# EAGLE design MultiEffect (EAGLE 9.6.2)

## Sheet 1 of 2: Audio & Power
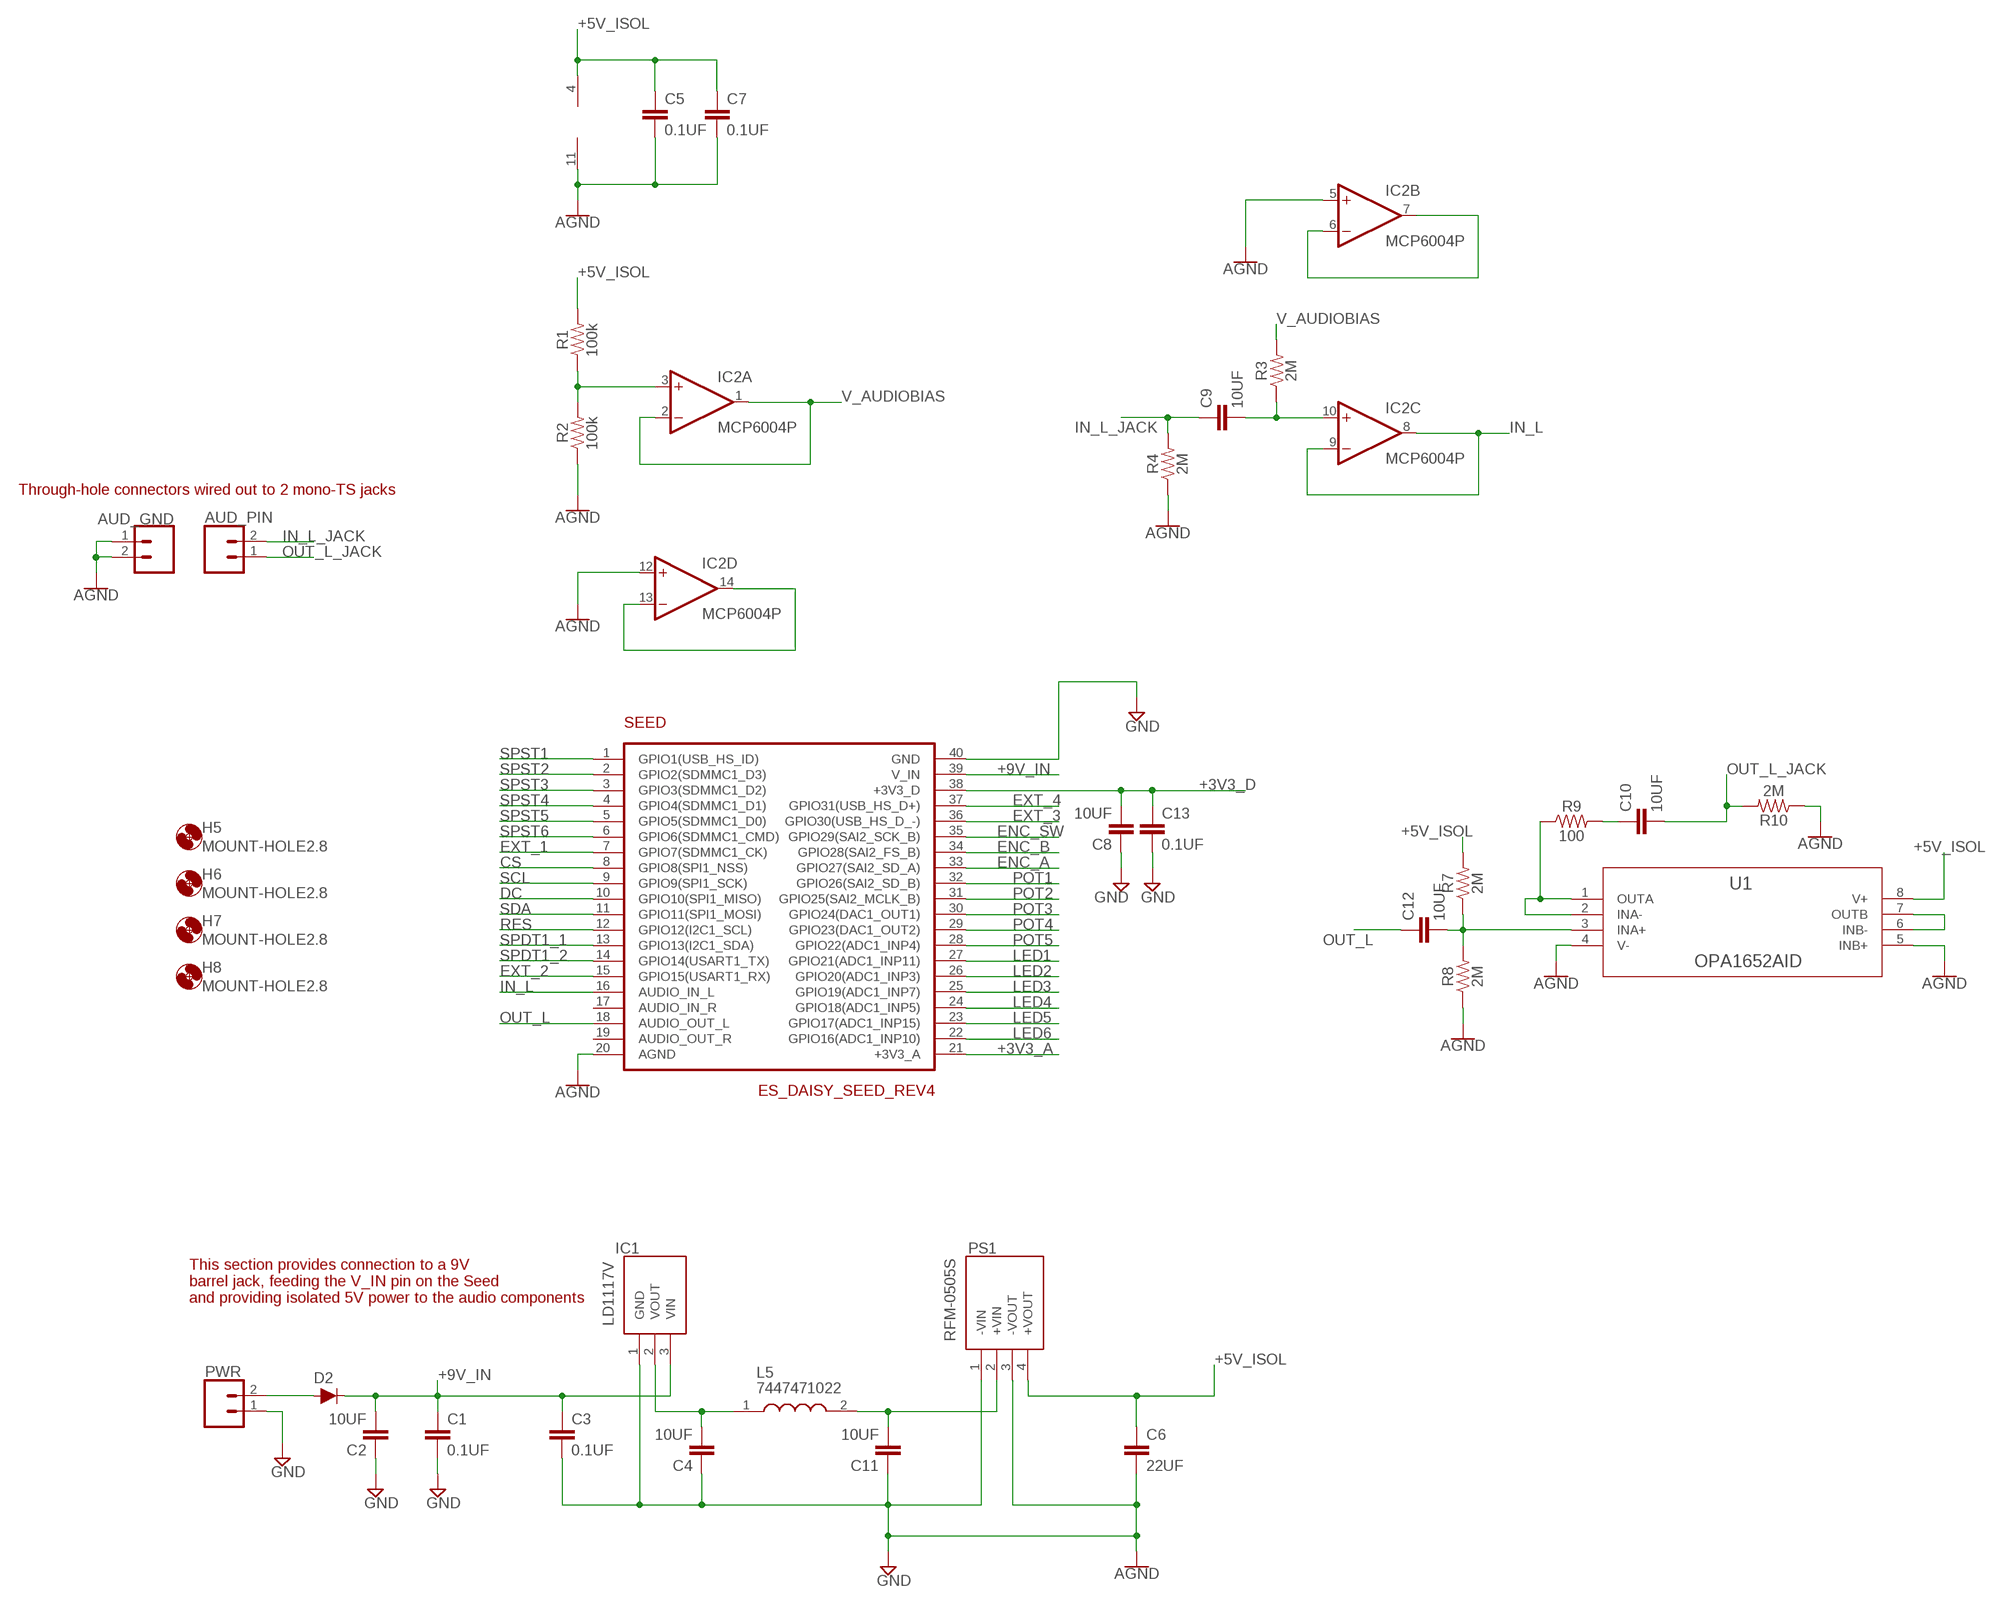
[diagram p0: schematic, sheet 1]

### Parts
AUD_GND  CONN_02  [1X02]
AUD_PIN  CONN_02  [1X02]
C1  0.1UF  [CAP-PTH-SMALL-KIT]
C2  10UF  [CAP-PTH-SMALL-KIT]
C3  0.1UF  [CAP-PTH-SMALL-KIT]
C4  10UF  [CAP-PTH-SMALL-KIT]
C5  0.1UF  [CAP-PTH-SMALL-KIT]
C6  22UF  [CAP-PTH-SMALL-KIT]
C7  0.1UF  [CAP-PTH-SMALL-KIT]
C8  10UF  [CAP-PTH-SMALL-KIT]
C9  10UF  [CAP-PTH-SMALL-KIT]
C10  10UF  [CAP-PTH-SMALL-KIT]
C11  10UF  [CAP-PTH-SMALL-KIT]
C12  10UF  [CAP-PTH-SMALL-KIT]
C13  0.1UF  [CAP-PTH-SMALL-KIT]
D2  200mA/100V/1V  DIODE-1N4148  [DIODE-1N4148]
H5  MOUNT-HOLE2.8  [2,8]
H6  MOUNT-HOLE2.8  [2,8]
H7  MOUNT-HOLE2.8  [2,8]
H8  MOUNT-HOLE2.8  [2,8]
IC1  LD1117V  [TO255P460X1020X2008-3P]
IC2  MCP6004P  [DIL14]
L5  7447471022  [WE-TIS_111190]
PS1  RFM-0505S  [RFM0505S]
PWR  CONN_02  [1X02]
R1  100k  100KOHM-HORIZ-1/4W-5%  [AXIAL-0.3]
R2  100k  100KOHM-HORIZ-1/4W-5%  [AXIAL-0.3]
R3  2M  2MOHM-HORIZ-1/4W-5%  [AXIAL-0.3]
R4  2M  2MOHM-HORIZ-1/4W-5%  [AXIAL-0.3]
R7  2M  2MOHM-HORIZ-1/4W-5%  [AXIAL-0.3]
R8  2M  2MOHM-HORIZ-1/4W-5%  [AXIAL-0.3]
R9  100  100OHM-HORIZ-1/4W-1%  [AXIAL-0.3]
R10  2M  2MOHM-HORIZ-1/4W-5%  [AXIAL-0.3]
SEED  ES_DAISY_SEED_REV4  [ES_DAISY_SEED]
U1  OPA1652AID  [D8]

### Nets
+3V3_A: SEED.21(+3V3_A) ; also sheet 2
+3V3_D: C8.2 C13.1 SEED.38(+3V3_D) ; also sheet 2
+5V_ISOL: C5.1 C6.1 C7.1 IC2.4(P:V+) PS1.4(+VOUT) R1.P$2 R7.P$2 U1.8(V+)
+9V_IN: C1.1 C2.2 C3.1 D2.C IC1.3(VIN) SEED.39(V_IN)
AGND: AUD_GND.1 AUD_GND.2 C5.2 C7.2 IC2.5(B:+IN) IC2.11(P:V-) IC2.12(D:+IN) R2.P$1 R4.P$1 R8.P$1 R10.P$1 SEED.20(AGND) U1.4(V-) U1.5(INB+)
CS: SEED.8(GPIO8(SPI1_NSS)) ; also sheet 2
DC: SEED.10(GPIO10(SPI1_MISO)) ; also sheet 2
ENC_A: SEED.33(GPIO27(SAI2_SD_A)) ; also sheet 2
ENC_B: SEED.34(GPIO28(SAI2_FS_B)) ; also sheet 2
ENC_SW: SEED.35(GPIO29(SAI2_SCK_B)) ; also sheet 2
EXT_1: SEED.7(GPIO7(SDMMC1_CK)) ; also sheet 2
EXT_2: SEED.15(GPIO15(USART1_RX)) ; also sheet 2
EXT_3: SEED.36(GPIO30(USB_HS_D_-)) ; also sheet 2
EXT_4: SEED.37(GPIO31(USB_HS_D+)) ; also sheet 2
GND: C1.2 C2.1 C3.2 C4.1 C6.2 C8.1 C11.1 C13.2 IC1.1(GND) PS1.1(-VIN) PS1.3(-VOUT) PWR.1 SEED.40(GND) ; supply symbol labelled AGND ; also sheet 2
IN_L: IC2.8(C:OUT) IC2.9(C:-IN) SEED.16(AUDIO_IN_L)
IN_L_JACK: AUD_PIN.2 C9.1 R4.P$2
LED1: SEED.27(GPIO21(ADC1_INP11)) ; also sheet 2
LED2: SEED.26(GPIO20(ADC1_INP3)) ; also sheet 2
LED3: SEED.25(GPIO19(ADC1_INP7)) ; also sheet 2
LED4: SEED.24(GPIO18(ADC1_INP5)) ; also sheet 2
LED5: SEED.23(GPIO17(ADC1_INP15)) ; also sheet 2
LED6: SEED.22(GPIO16(ADC1_INP10)) ; also sheet 2
N$2: D2.A PWR.2
N$6: IC2.3(A:+IN) R1.P$1 R2.P$2
N$7: C11.2 L5.2 PS1.2(+VIN)
N$8: C4.2 IC1.2(VOUT) L5.1
N$9: C9.2 IC2.10(C:+IN) R3.P$1
N$10: IC2.13(D:-IN) IC2.14(D:OUT)
N$12: C12.2 R7.P$1 R8.P$2 U1.3(INA+)
N$13: R9.P$1 U1.1(OUTA) U1.2(INA-)
N$14: C10.1 R9.P$2
N$15: U1.6(INB-) U1.7(OUTB)
N$18: IC2.6(B:-IN) IC2.7(B:OUT)
OUT_L: C12.1 SEED.18(AUDIO_OUT_L)
OUT_L_JACK: AUD_PIN.1 C10.2 R10.P$2
POT1: SEED.32(GPIO26(SAI2_SD_B)) ; also sheet 2
POT2: SEED.31(GPIO25(SAI2_MCLK_B)) ; also sheet 2
POT3: SEED.30(GPIO24(DAC1_OUT1)) ; also sheet 2
POT4: SEED.29(GPIO23(DAC1_OUT2)) ; also sheet 2
POT5: SEED.28(GPIO22(ADC1_INP4)) ; also sheet 2
RES: SEED.12(GPIO12(I2C1_SCL)) ; also sheet 2
SCL: SEED.9(GPIO9(SPI1_SCK)) ; also sheet 2
SDA: SEED.11(GPIO11(SPI1_MOSI)) ; also sheet 2
SPDT1_1: SEED.13(GPIO13(I2C1_SDA)) ; also sheet 2
SPDT1_2: SEED.14(GPIO14(USART1_TX)) ; also sheet 2
SPST1: SEED.1(GPIO1(USB_HS_ID)) ; also sheet 2
SPST2: SEED.2(GPIO2(SDMMC1_D3)) ; also sheet 2
SPST3: SEED.3(GPIO3(SDMMC1_D2)) ; also sheet 2
SPST4: SEED.4(GPIO4(SDMMC1_D1)) ; also sheet 2
SPST5: SEED.5(GPIO5(SDMMC1_D0)) ; also sheet 2
SPST6: SEED.6(GPIO6(SDMMC1_CMD)) ; also sheet 2
V_AUDIOBIAS: IC2.1(A:OUT) IC2.2(A:-IN) R3.P$2
Unconnected: SEED.17(AUDIO_IN_R) SEED.19(AUDIO_OUT_R)

### Notes on the sheet
- Through-hole connectors wired out to 2 mono-TS jacks
- This section provides connection to a 9V
  barrel jack, feeding the V_IN pin on the Seed 
  and providing isolated 5V power to the audio components

## Sheet 2 of 2: I/O
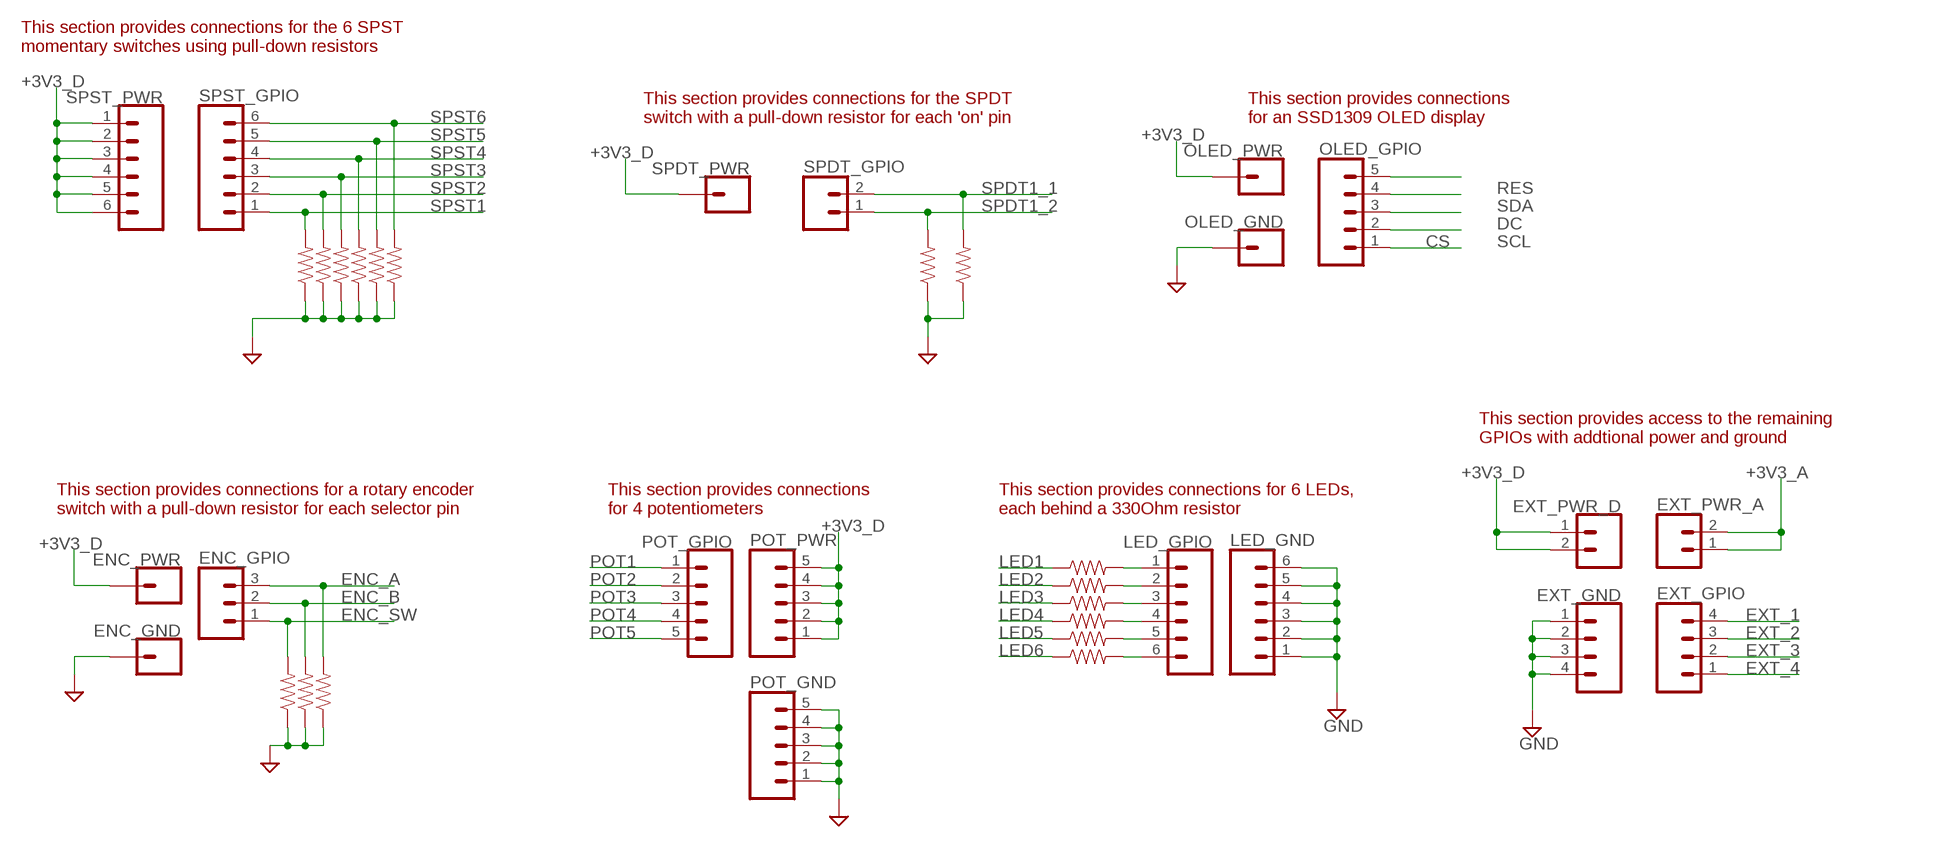
[diagram p1: schematic, sheet 2]

### Parts
D11  10k  10KOHM-HORIZ-1/4W-5%  [AXIAL-0.3]
D12  10k  10KOHM-HORIZ-1/4W-5%  [AXIAL-0.3]
ENC_GND  CONN_01  [1X01]
ENC_GPIO  CONN_03  [1X03]
ENC_PWR  CONN_01  [1X01]
EXT_GND  CONN_04  [1X04]
EXT_GPIO  CONN_04  [1X04]
EXT_PWR_A  CONN_02  [1X02]
EXT_PWR_D  CONN_02  [1X02]
H2  10k  10KOHM-HORIZ-1/4W-5%  [AXIAL-0.3]
H3  10k  10KOHM-HORIZ-1/4W-5%  [AXIAL-0.3]
H4  10k  10KOHM-HORIZ-1/4W-5%  [AXIAL-0.3]
L1  330  330OHM-HORIZ-1/10W-5%  [AXIAL-0.3]
L2  330  330OHM-HORIZ-1/10W-5%  [AXIAL-0.3]
L3  330  330OHM-HORIZ-1/10W-5%  [AXIAL-0.3]
L4  330  330OHM-HORIZ-1/10W-5%  [AXIAL-0.3]
L6  330  330OHM-HORIZ-1/10W-5%  [AXIAL-0.3]
L7  330  330OHM-HORIZ-1/10W-5%  [AXIAL-0.3]
LED_GND  CONN_06SILK_FEMALE_PTH  [1X06]
LED_GPIO  CONN_06SILK_FEMALE_PTH  [1X06]
OLED_GND  CONN_01  [1X01]
OLED_GPIO  CONN_05  [1X05]
OLED_PWR  CONN_01  [1X01]
POT_GND  CONN_05  [1X05]
POT_GPIO  CONN_05  [1X05]
POT_PWR  CONN_05  [1X05]
S1  10k  10KOHM-HORIZ-1/4W-5%  [AXIAL-0.3]
S2  10k  10KOHM-HORIZ-1/4W-5%  [AXIAL-0.3]
S3  10k  10KOHM-HORIZ-1/4W-5%  [AXIAL-0.3]
S4  10k  10KOHM-HORIZ-1/4W-5%  [AXIAL-0.3]
S5  10k  10KOHM-HORIZ-1/4W-5%  [AXIAL-0.3]
S6  10k  10KOHM-HORIZ-1/4W-5%  [AXIAL-0.3]
SPDT_GPIO  CONN_02  [1X02]
SPDT_PWR  CONN_01  [1X01]
SPST_GPIO  CONN_06SILK_FEMALE_PTH  [1X06]
SPST_PWR  CONN_06SILK_FEMALE_PTH  [1X06]

### Nets
+3V3_A: EXT_PWR_A.1 EXT_PWR_A.2 ; also sheet 1
+3V3_D: ENC_PWR.1 EXT_PWR_D.1 EXT_PWR_D.2 OLED_PWR.1 POT_PWR.1 POT_PWR.2 POT_PWR.3 POT_PWR.4 POT_PWR.5 SPDT_PWR.1 SPST_PWR.1 SPST_PWR.2 SPST_PWR.3 SPST_PWR.4 SPST_PWR.5 SPST_PWR.6 ; also sheet 1
CS: OLED_GPIO.1 ; also sheet 1
DC: OLED_GPIO.3 ; also sheet 1
ENC_A: ENC_GPIO.3 H4.P$2 ; also sheet 1
ENC_B: ENC_GPIO.2 H3.P$2 ; also sheet 1
ENC_SW: ENC_GPIO.1 H2.P$2 ; also sheet 1
EXT_1: EXT_GPIO.4 ; also sheet 1
EXT_2: EXT_GPIO.3 ; also sheet 1
EXT_3: EXT_GPIO.2 ; also sheet 1
EXT_4: EXT_GPIO.1 ; also sheet 1
GND: D11.P$1 D12.P$1 ENC_GND.1 EXT_GND.1 EXT_GND.2 EXT_GND.3 EXT_GND.4 H2.P$1 H3.P$1 H4.P$1 LED_GND.1 LED_GND.2 LED_GND.3 LED_GND.4 LED_GND.5 LED_GND.6 OLED_GND.1 POT_GND.1 POT_GND.2 POT_GND.3 POT_GND.4 POT_GND.5 S1.P$1 S2.P$1 S3.P$1 S4.P$1 S5.P$1 S6.P$1 ; also sheet 1
LED1: L1.P$1 ; also sheet 1
LED2: L2.P$1 ; also sheet 1
LED3: L3.P$1 ; also sheet 1
LED4: L4.P$1 ; also sheet 1
LED5: L6.P$1 ; also sheet 1
LED6: L7.P$1 ; also sheet 1
N$1: L1.P$2 LED_GPIO.1
N$3: L2.P$2 LED_GPIO.2
N$4: L3.P$2 LED_GPIO.3
N$5: L4.P$2 LED_GPIO.4
N$11: L6.P$2 LED_GPIO.5
N$16: L7.P$2 LED_GPIO.6
POT1: POT_GPIO.1 ; also sheet 1
POT2: POT_GPIO.2 ; also sheet 1
POT3: POT_GPIO.3 ; also sheet 1
POT4: POT_GPIO.4 ; also sheet 1
POT5: POT_GPIO.5 ; also sheet 1
RES: OLED_GPIO.5 ; also sheet 1
SCL: OLED_GPIO.2 ; also sheet 1
SDA: OLED_GPIO.4 ; also sheet 1
SPDT1_1: D11.P$2 SPDT_GPIO.2 ; also sheet 1
SPDT1_2: D12.P$2 SPDT_GPIO.1 ; also sheet 1
SPST1: S1.P$2 SPST_GPIO.1 ; also sheet 1
SPST2: S2.P$2 SPST_GPIO.2 ; also sheet 1
SPST3: S3.P$2 SPST_GPIO.3 ; also sheet 1
SPST4: S4.P$2 SPST_GPIO.4 ; also sheet 1
SPST5: S5.P$2 SPST_GPIO.5 ; also sheet 1
SPST6: S6.P$2 SPST_GPIO.6 ; also sheet 1

### Notes on the sheet
- This section provides connections for the 6 SPST 
  momentary switches using pull-down resistors
- This section provides connections for the SPDT 
  switch with a pull-down resistor for each 'on' pin
- This section provides connections 
  for an SSD1309 OLED display
- This section provides access to the remaining 
  GPIOs with addtional power and ground
- This section provides connections for a rotary encoder
  switch with a pull-down resistor for each selector pin
- This section provides connections
  for 4 potentiometers
- This section provides connections for 6 LEDs,
  each behind a 330Ohm resistor

## Library data of the parts
AUD_GND AUD_PIN EXT_PWR_A EXT_PWR_D PWR SPDT_GPIO = SparkFun-Connectors:CONN_02: Multi connection point. Often used as Generic Header-pin footprint for 0.1 inch spaced/style header connections On any of the 0.1 inch spaced packages, you can populate with these: Break Away Headers - Straight <https://www.sparkfun.com/products/116> (PRT-00116) Break Away Male Headers - Right Angle <https://www.sparkfun.com/products/553> (PRT-00553) Female Headers <https://www.sparkfun.com/products/115> (PRT-00115) Break Away Headers - Machine Pin <https://www.sparkfun.com/products/117> (PRT-00117) Break Away Female Headers - Swiss Machine Pin <https://www.sparkfun.com/products/743> (PRT-00743) For SCREWTERMINALS and SPRING TERMINALS visit here: Screw Terimnals on SparkFun.com <https://www.sparkfun.com/search/results?term=Screw+Terminals> (5mm/3.5mm/2.54mm spacing) This device is also useful as a general connection point to wire up your design to another part of your project. Our various solder wires solder well into these plated through hole pads. Hook-Up Wire - Assortment (Stranded, 22 AWG) <https://www.sparkfun.com/products/11375> (PRT-11375) Hook-Up Wire - Assortment (Solid Core, 22 AWG) <https://www.sparkfun.com/products/11367> (PRT-11367) View the entire wire category on our website here <https://www.sparkfun.com/categories/141> Special notes: Molex polarized connector foot print use with: PRT-08233 with associated crimp pins and housings. 2.54_SCREWTERM for use with PRT-10571. 3.5mm Screw Terminal footprints for PRT-08084 5mm Screw Terminal footprints for use with PRT-08432
C1 C3 C5 C7 C13 = Custom-Parts:0.1UF
C2 C4 C8-C12 = Custom-Parts:10UF
C6 = Custom-Parts:22UF
D2 = SparkFun-DiscreteSemi:DIODE: Diode These are standard reverse protection diodes and small signal diodes. SparkFun Products: SparkFun SparkPunk Sound Kit <https://www.sparkfun.com/products/11177> SparkFun ESP8266 Thing <https://www.sparkfun.com/products/13231>; PROD_ID: DIO-08378
D11 D12 H2-H4 S1-S6 = SparkFun-Resistors:10KOHM: 10kΩ resistor A resistor is a passive two-terminal electrical component that implements electrical resistance as a circuit element. Resistors act to reduce current flow, and, at the same time, act to lower voltage levels within circuits. - Wikipedia; PROD_ID: RES-09435
ENC_GND ENC_PWR OLED_GND OLED_PWR SPDT_PWR = SparkFun-Connectors:CONN_01: Single connection point. Often used as Generic Header-pin footprint for 0.1 inch spaced/style header connections On any of the 0.1 inch spaced packages, you can populate with these: Break Away Headers - Straight <https://www.sparkfun.com/products/116> (PRT-00116) Break Away Male Headers - Right Angle <https://www.sparkfun.com/products/553> (PRT-00553) Female Headers <https://www.sparkfun.com/products/115> (PRT-00115) Break Away Headers - Machine Pin <https://www.sparkfun.com/products/117> (PRT-00117) Break Away Female Headers - Swiss Machine Pin <https://www.sparkfun.com/products/743> (PRT-00743) This device is also useful as a general connection point to wire up your design to another part of your project. Our various solder wires solder well into these plated through hole pads. Hook-Up Wire - Assortment (Stranded, 22 AWG) <https://www.sparkfun.com/products/11375> (PRT-11375) Hook-Up Wire - Assortment (Solid Core, 22 AWG) <https://www.sparkfun.com/products/11367> (PRT-11367) View the entire wire category on our website here <https://www.sparkfun.com/categories/141> Special notes: SMTSO-256-ET is a "flush mount" nut for a 4-40 screw. We mostly use this on specialty testbeds; it is a nice way to connect hardware to your PCB at an adjustable hieght. Also note, the SNAP packages are for using a snappable style connector. We sell a baggie of snaps and they are also used on two LilyPad designs: Snap Assortment - 30 pack (male and female) <https://www.sparkfun.com/products/11347> (DEV-11347) LilyPad Arduino SimpleSnap <https://www.sparkfun.com/products/10941> (DEV-10941) LilyPad SimpleSnap Protoboard <https://www.sparkfun.com/products/10940> (DEV-10940)
ENC_GPIO = SparkFun-Connectors:CONN_03: Multi connection point. Often used as Generic Header-pin footprint for 0.1 inch spaced/style header connections On any of the 0.1 inch spaced packages, you can populate with these: Break Away Headers - Straight <https://www.sparkfun.com/products/116> (PRT-00116) Break Away Male Headers - Right Angle <https://www.sparkfun.com/products/553> (PRT-00553) Female Headers <https://www.sparkfun.com/products/115> (PRT-00115) Break Away Headers - Machine Pin <https://www.sparkfun.com/products/117> (PRT-00117) Break Away Female Headers - Swiss Machine Pin <https://www.sparkfun.com/products/743> (PRT-00743) Stackable Header - 3 Pin (Female, 0.1") <https://www.sparkfun.com/products/13875> (PRT-13875) For SCREWTERMINALS and SPRING TERMINALS visit here: Screw Terimnals on SparkFun.com <https://www.sparkfun.com/search/results?term=Screw+Terminals> (5mm/3.5mm/2.54mm spacing) This device is also useful as a general connection point to wire up your design to another part of your project. Our various solder wires solder well into these plated through hole pads. Hook-Up Wire - Assortment (Stranded, 22 AWG) <https://www.sparkfun.com/products/11375> (PRT-11375) Hook-Up Wire - Assortment (Solid Core, 22 AWG) <https://www.sparkfun.com/products/11367> (PRT-11367) View the entire wire category on our website here <https://www.sparkfun.com/categories/141> Special notes: Molex polarized connector foot print use with SKU : PRT-08232 with associated crimp pins and housings.
EXT_GND EXT_GPIO = SparkFun-Connectors:CONN_04: Multi connection point. Often used as Generic Header-pin footprint for 0.1 inch spaced/style header connections On any of the 0.1 inch spaced packages, you can populate with these: Break Away Headers - Straight <https://www.sparkfun.com/products/116> (PRT-00116) Break Away Male Headers - Right Angle <https://www.sparkfun.com/products/553> (PRT-00553) Female Headers <https://www.sparkfun.com/products/115> (PRT-00115) Break Away Headers - Machine Pin <https://www.sparkfun.com/products/117> (PRT-00117) Break Away Female Headers - Swiss Machine Pin <https://www.sparkfun.com/products/743> (PRT-00743) For SCREWTERMINALS and SPRING TERMINALS visit here: Screw Terimnals on SparkFun.com <https://www.sparkfun.com/search/results?term=Screw+Terminals> (5mm/3.5mm/2.54mm spacing) This device is also useful as a general connection point to wire up your design to another part of your project. Our various solder wires solder well into these plated through hole pads. Hook-Up Wire - Assortment (Stranded, 22 AWG) <https://www.sparkfun.com/products/11375> (PRT-11375) Hook-Up Wire - Assortment (Solid Core, 22 AWG) <https://www.sparkfun.com/products/11367> (PRT-11367) View the entire wire category on our website here <https://www.sparkfun.com/categories/141> Special notes: Molex polarized connector foot print use with SKU : PRT-08231 with associated crimp pins and housings. 1MM SMD Version SKU: PRT-10208; PROD_ID: CONN-09696
H5-H8 = holes:MOUNT-HOLE: MOUNTING HOLE with drill center marker
IC1 = SamacSys_Parts:LD1117V: I.C. LD1117V Source: Datasheet <https://www.mouser.com/datasheet/2/389/ld1117-974075.pdf>; ARROW_PART_NUMBER: LD1117V; ARROW_PRICE-STOCK: https://www.arrow.com/en/products/ld1117v/stmicroelectronics; DESCRIPTION: I.C. LD1117V; HEIGHT: 4.6mm; MANUFACTURER_NAME: STMicroelectronics; MANUFACTURER_PART_NUMBER: LD1117V; MOUSER_PART_NUMBER: 511-LD1117V; MOUSER_PRICE-STOCK: https://www.mouser.co.uk/ProductDetail/STMicroelectronics/LD1117V?qs=tZUCD5p2VWqhC74a4KMNzA%3D%3D
IC2 = Custom-Parts:MCP6004: Quad Op Amp 2.7V to 6.0V Single Supply CMOS Source: https://www.mouser.com/datasheet/2/268/21733e-41017.pdf
L1-L4 L6 L7 = SparkFun-Resistors:330OHM: 330Ω resistor A resistor is a passive two-terminal electrical component that implements electrical resistance as a circuit element. Resistors act to reduce current flow, and, at the same time, act to lower voltage levels within circuits. - Wikipedia; PROD_ID: RES-8371
L5 = SamacSys_Parts:7447471022: Wurth 2.2 uH +/-20% Ferrite Leaded Inductor, Max SRF:75MHz, 10A Idc, 0.009 Rdc WE-TIS Source: Datasheet <https://componentsearchengine.com/Datasheets/1/7447471022.pdf>; DESCRIPTION: Wurth 2.2 uH +/-20% Ferrite Leaded Inductor, Max SRF:75MHz, 10A Idc, 0.009 Rdc WE-TIS; HEIGHT: mm; MANUFACTURER_NAME: Wurth Elektronik; MANUFACTURER_PART_NUMBER: 7447471022; MOUSER_PART_NUMBER: 710-7447471022; MOUSER_PRICE-STOCK: https://www.mouser.com/Search/Refine.aspx?Keyword=710-7447471022
LED_GND LED_GPIO SPST_GPIO SPST_PWR = SparkFun-Connectors:CONN_06: Multi connection point. Often used as Generic Header-pin footprint for 0.1 inch spaced/style header connections On any of the 0.1 inch spaced packages, you can populate with these: Break Away Headers - Straight <https://www.sparkfun.com/products/116> (PRT-00116) Break Away Male Headers - Right Angle <https://www.sparkfun.com/products/553> (PRT-00553) Female Headers <https://www.sparkfun.com/products/115> (PRT-00115) Break Away Headers - Machine Pin <https://www.sparkfun.com/products/117> (PRT-00117) Break Away Female Headers - Swiss Machine Pin <https://www.sparkfun.com/products/743> (PRT-00743) Arduino Stackable Header - 6 Pin <https://www.sparkfun.com/products/9280> (PRT-09280) For SCREWTERMINALS and SPRING TERMINALS visit here: Screw Terimnals on SparkFun.com <https://www.sparkfun.com/search/results?term=Screw+Terminals> (5mm/3.5mm/2.54mm spacing) This device is also useful as a general connection point to wire up your design to another part of your project. Our various solder wires solder well into these plated through hole pads. Hook-Up Wire - Assortment (Stranded, 22 AWG) <https://www.sparkfun.com/products/11375> (PRT-11375) Hook-Up Wire - Assortment (Solid Core, 22 AWG) <https://www.sparkfun.com/products/11367> (PRT-11367) View the entire wire category on our website here <https://www.sparkfun.com/categories/141>; PROD_ID: CONN-08437
OLED_GPIO POT_GND POT_GPIO POT_PWR = SparkFun-Connectors:CONN_05: Multi connection point. Often used as Generic Header-pin footprint for 0.1 inch spaced/style header connections On any of the 0.1 inch spaced packages, you can populate with these: Break Away Headers - Straight <https://www.sparkfun.com/products/116> (PRT-00116) Break Away Male Headers - Right Angle <https://www.sparkfun.com/products/553> (PRT-00553) Female Headers <https://www.sparkfun.com/products/115> (PRT-00115) Break Away Headers - Machine Pin <https://www.sparkfun.com/products/117> (PRT-00117) Break Away Female Headers - Swiss Machine Pin <https://www.sparkfun.com/products/743> (PRT-00743) For SCREWTERMINALS and SPRING TERMINALS visit here: Screw Terimnals on SparkFun.com <https://www.sparkfun.com/search/results?term=Screw+Terminals> (5mm/3.5mm/2.54mm spacing) This device is also useful as a general connection point to wire up your design to another part of your project. Our various solder wires solder well into these plated through hole pads. Hook-Up Wire - Assortment (Stranded, 22 AWG) <https://www.sparkfun.com/products/11375> (PRT-11375) Hook-Up Wire - Assortment (Solid Core, 22 AWG) <https://www.sparkfun.com/products/11367> (PRT-11367) View the entire wire category on our website here <https://www.sparkfun.com/categories/141> Special notes: Molex polarized connector foot print use with SKU : PRT-08231 with associated crimp pins and housings. 1MM SMD Version SKU: PRT-10208
PS1 = SamacSys_Parts:RFM-0505S: RECOM POWER - RFM-0505S - DC-DC CONVERTER, 5V, 0.2A Source: Datasheet <https://www.recom-power.com/pdf/Econoline/RFM.pdf>; DESCRIPTION: RECOM POWER - RFM-0505S - DC-DC CONVERTER, 5V, 0.2A; HEIGHT: 10.5mm; MANUFACTURER_NAME: RECOM Power; MANUFACTURER_PART_NUMBER: RFM-0505S; MOUSER_PART_NUMBER: 919-RFM-0505S; MOUSER_PRICE-STOCK: https://www.mouser.co.uk/ProductDetail/RECOM-Power/RFM-0505S?qs=lYGu3FyN48dRVYKTH5ipqg%3D%3D
R1 R2 = SparkFun-Resistors:100KOHM: 100kΩ resistor A resistor is a passive two-terminal electrical component that implements electrical resistance as a circuit element. Resistors act to reduce current flow, and, at the same time, act to lower voltage levels within circuits. - Wikipedia; PROD_ID: RES-10686
R3 R4 R7 R8 R10 = Custom-Parts:2MOHM: 2MΩ resistor A resistor is a passive two-terminal electrical component that implements electrical resistance as a circuit element. Resistors act to reduce current flow, and, at the same time, act to lower voltage levels within circuits. - Wikipedia; PROD_ID: RES-09329
R9 = SparkFun-Resistors:100OHM: 100Ω resistor A resistor is a passive two-terminal electrical component that implements electrical resistance as a circuit element. Resistors act to reduce current flow, and, at the same time, act to lower voltage levels within circuits. - Wikipedia; PROD_ID: RES-12181
SEED = Electrosmith-Boards:ES_DAISY_SEED_REV4; IPN: Daisy Seed
U1 = Custom-Parts:OPA1652AID; DATASHEET_URL: http://www.ti.com/lit/gpn/OPA1652; DESCRIPTION: Sound Plus Low Noise and Distortion, General-Purpose, FET-Input Audio Op Amps; FAMILY_NAME: LOW NOISE; GENERIC_PART_NUMBER: OPA1652; INDUSTRY_STD_PKG_TYPE: SOIC; MANUFACTURER: Texas Instruments; MANUFACTURER_PART_NUMBER: OPA1652AID; PACKAGE_DESIGNATOR: D; PIN_COUNT: 8; VENDOR: Texas Instruments

## Net classes
0 DEFAULT: width 0.102 mm, drill 0.2 mm, clearance 0.102 mm

## Board
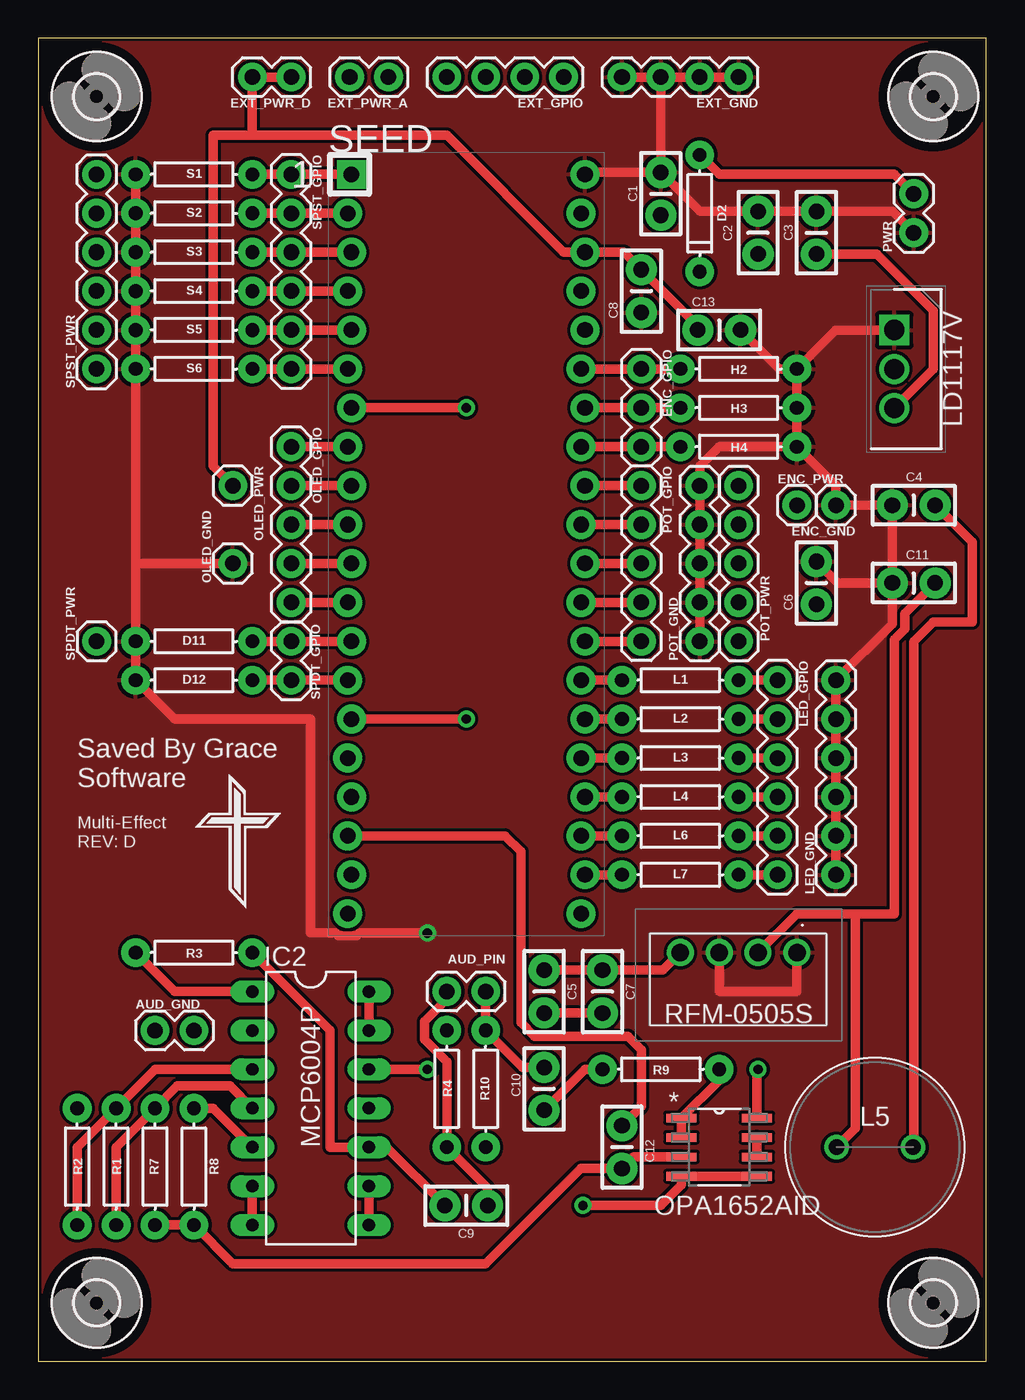
[diagram p2: board, top side]
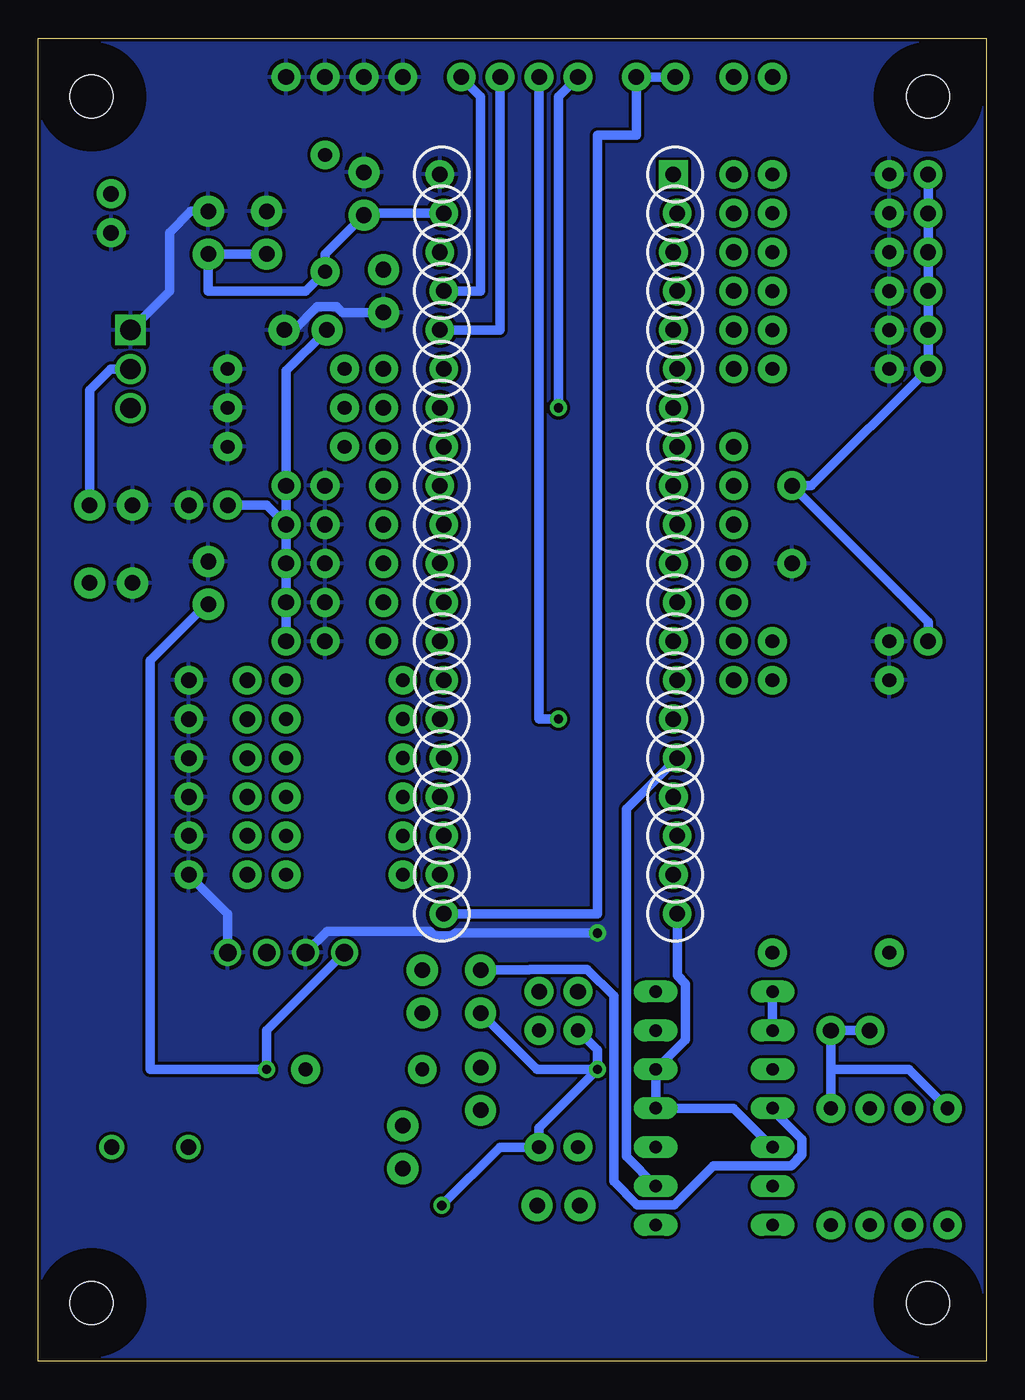
[diagram p3: board, bottom side, seen from below]

Size 61.9 x 86.35 mm. Coordinates in mm from the lower left corner, seen from the top.
Outline: 0,0 61.9,0 61.9,86.35 0,86.35 0,0
Copper layers (1*16): Top 0.035mm / dielectric 1.5mm / Bottom 0.035mm
Design rules "SparkFun": minimum track width 8mil, minimum drill 20mil, track to track 8mil, track to pad 8mil, pad to pad 8mil, via to via 8mil, smd to smd 8mil, copper to edge 8mil, drill to drill 8mil, minimum pad ring 12mil, minimum via ring 10mil, stop-mask expansion 4mil, vias tented up to drill 20mil, thermal gap 10mil

### Footprints (pad centres in the part's own frame; a part is rotated, then mirrored left to right if it is on the bottom)
1X02 = drill 1.016 pad 1.88: 1 0,0; 2 2.54,0
CAP-PTH-SMALL-KIT = drill 1.016 pad 2.032: 1 -1.397,0; 2 1.397,0
DIODE-1N4148 = drill 0.9 pad 1.88: A -3.81,0; C 3.81,0
AXIAL-0.3 = drill 0.9 pad 1.88: P$1 -3.81,0; P$2 3.81,0
1X01 = drill 1.016 pad 1.88: 1 0,0
1X03 = drill 1.016 pad 1.88: 1 0,0; 2 2.54,0; 3 5.08,0
1X04 = drill 1.016 pad 1.88: 1 0,0; 2 2.54,0; 3 5.08,0; 4 7.62,0
2,8 = hole 2.8: 0,0
TO255P460X1020X2008-3P = drill 1.32 pad 1.98 square: 1 0,0 | drill 1.32 pad 1.98: 2 2.55,0; 3 5.1,0
DIL14 = drill 0.813 long: 1 -7.62,-3.81; 2 -5.08,-3.81; 3 -2.54,-3.81; 4 0,-3.81; 5 2.54,-3.81; 6 5.08,-3.81; 7 7.62,-3.81; 8 7.62,3.81; 9 5.08,3.81; 10 2.54,3.81; 11 0,3.81; 12 -2.54,3.81; 13 -5.08,3.81; 14 -7.62,3.81
WE-TIS_111190 = drill 1 pad 1.5: 1 -2.5,0; 2 2.5,0
1X06 = drill 1.016 pad 1.88: 1 0,0; 2 2.54,0; 3 5.08,0; 4 7.62,0; 5 10.16,0; 6 12.7,0
1X05 = drill 1.016 pad 1.88: 1 0,0; 2 2.54,0; 3 5.08,0; 4 7.62,0; 5 10.16,0
RFM0505S = drill 1.15 pad 1.725: 1 0,0; 2 2.54,0; 3 5.08,0; 4 7.62,0
ES_DAISY_SEED = drill 1.016 pad 1.88 square: 1 -7.493,24.13 | drill 1.016 pad 1.88: 2 -7.747,21.59; 3 -7.493,19.05; 4 -7.747,16.51; 5 -7.493,13.97; 6 -7.747,11.43; 7 -7.493,8.89; 8 -7.747,6.35; 9 -7.493,3.81; 10 -7.747,1.27; 11 -7.493,-1.27; 12 -7.747,-3.81; 13 -7.493,-6.35; 14 -7.747,-8.89; 15 -7.493,-11.43; 16 -7.747,-13.97; 17 -7.493,-16.51; 18 -7.747,-19.05; 19 -7.493,-21.59; 20 -7.747,-24.13; 21 7.493,-24.13; 22 7.747,-21.59; 23 7.493,-19.05; 24 7.747,-16.51; 25 7.493,-13.97; 26 7.747,-11.43; 27 7.493,-8.89; 28 7.747,-6.35; 29 7.493,-3.81; 30 7.747,-1.27; 31 7.493,1.27; 32 7.747,3.81; 33 7.493,6.35; 34 7.747,8.89; 35 7.493,11.43; 36 7.747,13.97; 37 7.493,16.51; 38 7.747,19.05; 39 7.493,21.59; 40 7.747,24.13
D8 = smd 1.981 x 0.559: 1 -2.464,1.905; 2 -2.464,0.635; 3 -2.464,-0.635; 4 -2.464,-1.905; 5 2.464,-1.905; 6 2.464,-0.635; 7 2.464,0.635; 8 2.464,1.905

### Placement (x,y rotation side)
AUD_GND  7.62,21.59 0 top
AUD_PIN  29.21,24.13 180 top
C1  40.64,76.2 90 top
C2  46.99,73.66 270 top
C3  50.8,73.66 90 top
C4  57.15,55.88 0 top
C5  33.02,24.13 270 top
C6  50.8,50.8 90 top
C7  36.83,24.13 270 top
C8  39.37,69.85 90 top
C9  27.94,10.16 180 top
C10  33.02,17.78 90 top
C11  57.15,50.8 0 top
C12  38.1,13.97 270 top
C13  44.45,67.31 0 top
D2  43.18,74.93 270 top
D11  10.16,46.99 0 top
D12  10.16,44.45 0 top
ENC_GND  52.07,55.88 180 top
ENC_GPIO  39.37,64.77 270 top
ENC_PWR  49.53,55.88 0 top
EXT_GND  45.72,83.82 180 top
EXT_GPIO  34.29,83.82 180 top
EXT_PWR_A  22.86,83.82 180 top
EXT_PWR_D  16.51,83.82 180 top
H2  45.72,64.77 180 top
H3  45.72,62.23 180 top
H4  45.72,59.69 180 top
H5  3.81,3.81 0 top
H6  58.42,82.55 0 top
H7  58.42,3.81 0 top
H8  3.81,82.55 0 top
IC1  55.88,67.31 270 top
IC2  17.78,16.51 270 top
L1  41.91,44.45 0 top
L2  41.91,41.91 0 top
L3  41.91,39.37 0 top
L4  41.91,36.83 0 top
L5  54.61,13.97 180 top
L6  41.91,34.29 0 top
L7  41.91,31.75 0 top
LED_GND  52.07,31.75 90 top
LED_GPIO  48.26,44.45 270 top
OLED_GND  12.7,52.07 90 top
OLED_GPIO  16.51,59.69 270 top
OLED_PWR  12.7,57.15 270 top
POT_GND  43.18,46.99 90 top
POT_GPIO  39.37,57.15 270 top
POT_PWR  45.72,46.99 90 top
PS1  49.53,26.67 180 top
PWR  57.15,73.66 90 top
R1  5.08,12.7 270 top
R2  2.54,12.7 270 top
R3  10.16,26.67 180 top
R4  26.67,17.78 270 top
R7  7.62,12.7 90 top
R8  10.16,12.7 270 top
R9  40.64,19.05 180 top
R10  29.21,17.78 90 top
S1  10.16,77.47 0 top
S2  10.16,74.93 0 top
S3  10.16,72.39 0 top
S4  10.16,69.85 0 top
S5  10.16,67.31 0 top
S6  10.16,64.77 0 top
SEED  27.94,53.34 0 top
SPDT_GPIO  16.51,44.45 90 top
SPDT_PWR  3.81,46.99 90 top
SPST_GPIO  16.51,77.47 270 top
SPST_PWR  3.81,64.77 90 top
U1  44.45,13.97 0 top

### Tracks (layer width: path | path; a pad name or v marks a point on that pad's centre or on a via)
+3V3_A
  Bottom 0.61: SEED.21 25.4,29.21 25.4,80.01 22.86,80.01 EXT_PWR_A.1 EXT_PWR_A.2
+3V3_D
  Top 0.61: OLED_PWR.1 11.43,58.42 11.43,80.01 13.97,80.01 | 13.97,80.01 26.67,80.01 34.29,72.39 SEED.38 38.23,72.39 C8.2 43.05,67.56 C13.1 | 13.97,80.01 EXT_PWR_D.2 EXT_PWR_D.1
  Bottom 0.61: SPST_PWR.6 SPST_PWR.5 SPST_PWR.4 SPST_PWR.3 SPST_PWR.2 SPST_PWR.1 11.43,57.15 OLED_PWR.1 3.81,48.26 SPDT_PWR.1 | POT_PWR.4 POT_PWR.5 45.72,64.64 C13.1 | POT_PWR.4 POT_PWR.3 POT_PWR.2 POT_PWR.1 | POT_PWR.4 46.99,55.88 ENC_PWR.1
+5V_ISOL  (via drill 0.6)
  Top 0.61: PS1.4 40.77,25.53 C7.1 C5.1 | R1.P$2 5.08,13.97 R7.P$2 9.07,17.96 12.52,17.96 IC2.4 | v46.99,19.05 46.91,18.97 U1.8
  Bottom 0.61: C6.1 50.93,49.4 54.61,45.72 54.61,19.05 v46.99,19.05 46.99,21.59 PS1.4 | C5.1 29.86,25.53 29.81,25.58 26.07,25.58 24.33,23.84 24.33,11.74 22.81,10.21 20.37,10.21 17.83,12.75 12.75,12.75 12.04,13.46 12.04,14.47 13.97,16.41 IC2.4
+9V_IN
  Top 0.61: IC1.3 58.42,64.75 58.42,68.58 54.74,72.26 C3.1
  Bottom 0.61: C2.2 C3.1 50.8,69.85 44.45,69.85 D2.C 43.18,72.26 C1.1 40.51,74.93 SEED.39
AGND  (via drill 0.6)
  Top 0.61: C5.2 C7.2 | R8.P$1 11.43,16.51 IC2.5 | v35.56,10.16 40.64,10.16 41.99,11.51 U1.4 U1.5 | IC2.12 v25.4,19.05
  Bottom 0.61: AUD_GND.1 AUD_GND.2 10.16,19.05 | IC2.5 16.51,16.51 IC2.11 IC2.12 19.66,20.98 19.66,24.64 20.19,25.17 SEED.20 | v25.4,19.05 25.4,20.32 R4.P$1 | 10.16,19.05 5.08,19.05 R2.P$1 | R8.P$1 10.16,19.05 | v35.56,10.16 31.75,13.97 R10.P$1 29.21,15.24 v25.4,19.05 | C5.2 29.34,19.05 v25.4,19.05
CS
  Top 0.61: OLED_GPIO.1 SEED.8
DC
  Top 0.61: OLED_GPIO.3 SEED.10
ENC_A
  Top 0.61: H4.P$2 ENC_GPIO.3 SEED.33
ENC_B
  Top 0.61: SEED.34 ENC_GPIO.2 H3.P$2
ENC_SW
  Top 0.61: SEED.35 ENC_GPIO.1 H2.P$2
EXT_1  (via drill 0.6)
  Top 0.61: SEED.7 v27.94,62.23
  Bottom 0.61: EXT_GPIO.4 27.94,82.55 v27.94,62.23
EXT_2  (via drill 0.6)
  Top 0.61: SEED.15 v27.94,41.91
  Bottom 0.61: v27.94,41.91 29.21,41.91 EXT_GPIO.3
EXT_3
  Bottom 0.61: SEED.36 31.75,67.31 EXT_GPIO.2
EXT_4
  Bottom 0.61: SEED.37 33.02,69.85 33.02,82.55 EXT_GPIO.1
GND  (via drill 0.6)
  Top 0.61: H2.P$1 H3.P$1 H4.P$1 | PS1.3 44.45,24.13 49.53,24.13 PS1.1 | C11.1 C4.1 ENC_GND.1 52.07,57.15 H4.P$1 | C1.2 43.18,75.06 C2.1 C3.2 55.75,75.06 PWR.1 | C6.2 52.2,50.8 C11.1 | H2.P$1 52.07,67.31 IC1.1 | POT_GND.1 POT_GND.2 POT_GND.3 POT_GND.4 POT_GND.5 43.18,58.42 44.45,59.69 H4.P$1 | LED_GND.1 LED_GND.2 LED_GND.3 LED_GND.4 LED_GND.5 LED_GND.6 55.75,48.13 C11.1 | 6.35,52.07 D11.P$1 D12.P$1 8.89,41.91 17.78,41.91 17.78,27.94 19.42,27.94 19.59,27.76 20.79,27.76 20.97,27.94 v25.4,27.94 | 6.35,52.07 S6.P$1 S5.P$1 S4.P$1 S3.P$1 S2.P$1 S1.P$1 | OLED_GND.1 6.35,52.07 | EXT_GND.4 EXT_GND.3 | EXT_GND.3 EXT_GND.2 EXT_GND.1 | SEED.40 35.81,77.6 C1.2 | EXT_GND.3 C1.2 | C13.2 48.39,64.77 H2.P$1
  Bottom 0.61: C3.2 51.94,75.06 53.34,73.66 53.34,69.85 IC1.1 | PS1.1 49.53,29.21 LED_GND.1 | PS1.3 43.06,28.06 36.33,28.06 36.03,27.76 34.83,27.76 34.66,27.94 v25.4,27.94 | C13.2 45.21,67.31 43.68,68.83 42.42,68.83 42.04,68.45 C8.1
  pour Top: 0,0 0,86.36 62.23,86.36 62.23,0
  pour Bottom: 0,86.36 0,0 62.23,0 62.23,86.36
IN_L
  Top 0.61: IC2.8 IC2.9
  Bottom 0.61: IC2.9 23.52,13.36 23.52,36.04 SEED.16
IN_L_JACK
  Top 0.61: C9.1 29.34,11.3 R4.P$2 26.67,19.54 25.22,20.99 25.22,22.19 26.67,23.64 AUD_PIN.2
LED1
  Top 0.61: SEED.27 L1.P$1
LED2
  Top 0.61: SEED.26 L2.P$1
LED3
  Top 0.61: SEED.25 L3.P$1
LED4
  Top 0.61: SEED.24 L4.P$1
LED5
  Top 0.61: SEED.23 L6.P$1
LED6
  Top 0.61: SEED.22 L7.P$1
N$1
  Top 0.61: L1.P$2 LED_GPIO.1
N$2
  Top 0.61: D2.A 44.45,77.47 55.88,77.47 PWR.2
N$3
  Top 0.61: L2.P$2 LED_GPIO.2
N$4
  Top 0.61: L3.P$2 LED_GPIO.3
N$5
  Top 0.61: L4.P$2 LED_GPIO.4
N$6
  Top 0.61: R2.P$2 2.54,13.97 R1.P$1 7.62,19.05 IC2.3
N$7
  Top 0.61: PS1.2 49.53,29.21 53.34,29.21 | 53.34,29.21 53.34,15.2 L5.2 | 53.34,29.21 55.88,29.21 55.88,47.11 56.57,47.8 56.57,48.82 C11.2
N$8
  Top 0.61: L5.1 57.15,14.01 57.15,46.99 58.42,48.26 60.96,48.26 60.96,53.47 C4.2
  Bottom 0.61: IC1.2 57.16,64.76 58.55,63.37 C4.2
N$9
  Top 0.61: C9.2 22.73,13.97 IC2.10 19.05,13.97 19.05,21.59 R3.P$1
N$10
  Top 0.61: IC2.14 IC2.13
N$11
  Top 0.61: L6.P$2 LED_GPIO.5
N$12
  Top 0.61: R7.P$1 R8.P$2 12.7,6.35 29.21,6.35 35.43,12.57 C12.2 38.86,13.34 U1.3
N$13
  Top 0.61: U1.2 U1.1 44.45,18.34 R9.P$1
N$14
  Top 0.61: R9.P$2 35.69,19.05 C10.1
N$15
  Top 0.61: U1.7 U1.6
N$16
  Top 0.61: L7.P$2 LED_GPIO.6
N$18
  Top 0.61: IC2.6 IC2.7
OUT_L
  Top 0.61: SEED.18 30.48,34.29 31.5,33.27 31.5,22.1 32.39,21.21 38.48,21.21 39.37,20.32 39.37,16.64 C12.1
OUT_L_JACK
  Top 0.61: C10.2 31.62,19.18 R10.P$2 AUD_PIN.1
POT1
  Top 0.61: SEED.32 POT_GPIO.1
POT2
  Top 0.61: SEED.31 POT_GPIO.2
POT3
  Top 0.61: SEED.30 POT_GPIO.3
POT4
  Top 0.61: SEED.29 POT_GPIO.4
POT5
  Top 0.61: SEED.28 POT_GPIO.5
RES
  Top 0.61: OLED_GPIO.5 SEED.12
SCL
  Top 0.61: OLED_GPIO.2 SEED.9
SDA
  Top 0.61: OLED_GPIO.4 SEED.11
SPDT1_1
  Top 0.61: SEED.13 SPDT_GPIO.2 D11.P$2
SPDT1_2
  Top 0.61: SEED.14 SPDT_GPIO.1 D12.P$2
SPST1
  Top 0.61: S1.P$2 SPST_GPIO.1 SEED.1
SPST2
  Top 0.61: S2.P$2 SPST_GPIO.2 SEED.2
SPST3
  Top 0.61: S3.P$2 SPST_GPIO.3 SEED.3
SPST4
  Top 0.61: S4.P$2 SPST_GPIO.4 SEED.4
SPST5
  Top 0.61: SEED.5 SPST_GPIO.5 S5.P$2
SPST6
  Top 0.61: SEED.6 SPST_GPIO.6 S6.P$2
V_AUDIOBIAS
  Top 0.61: IC2.1 8.89,24.13 R3.P$2
  Bottom 0.61: IC2.1 IC2.2

### Text on the board
tNames: Saved By Grace / Software | Multi-Effect / REV: D